# EAGLE design FSWSJE2IZ6BVKJ2 (EAGLE 9.5.2)
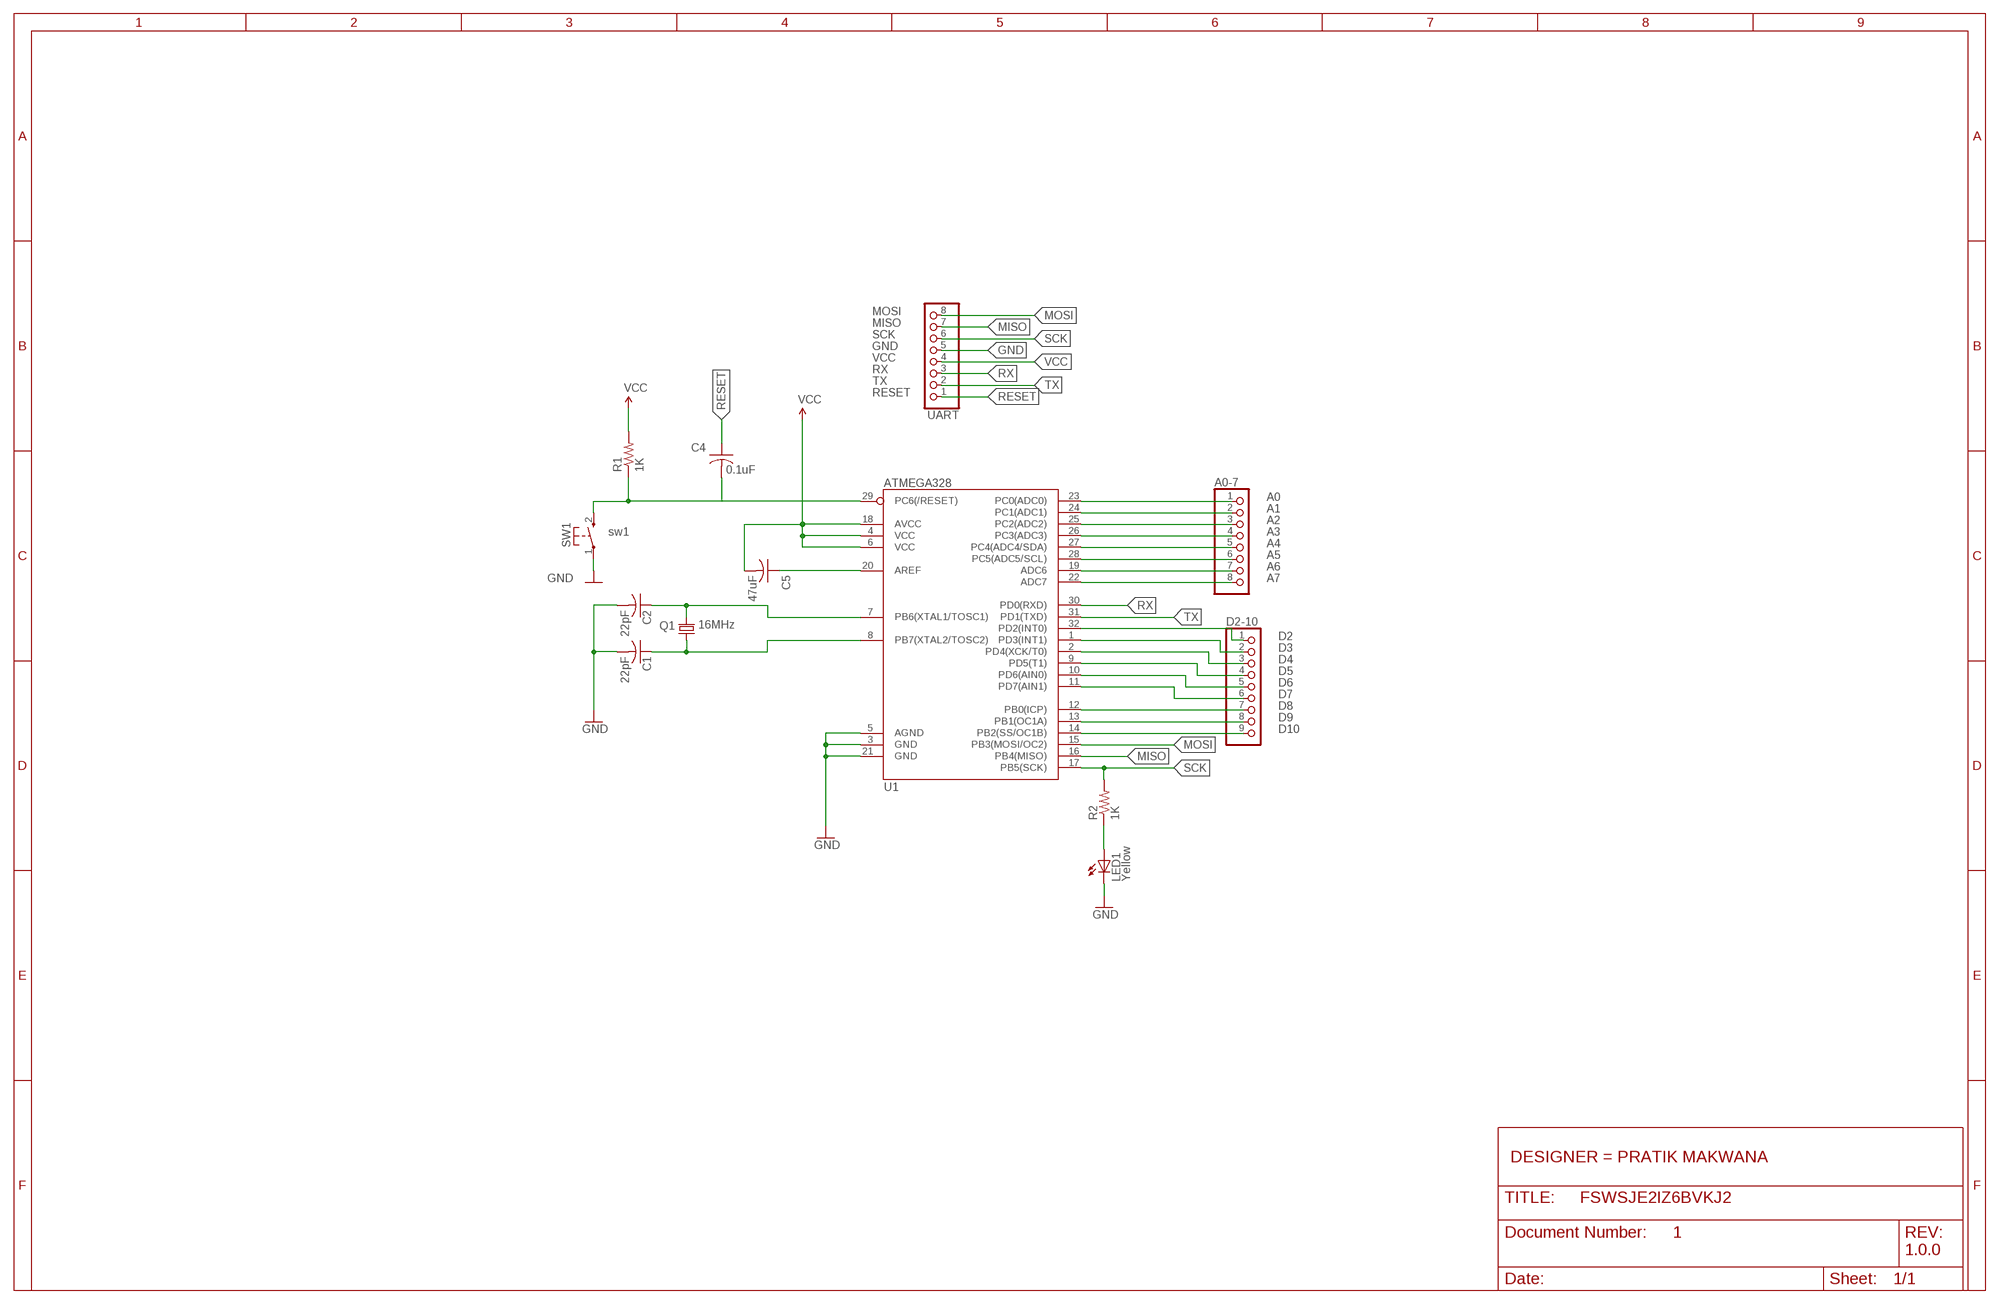
[diagram p0: schematic, sheet 1]
FRAME1 (FRAME_B_L): DESIGNER: PRATIK MAKWANA; DOC: 1; REV: 1.0.0

## Parts
A0-7  PINHD-1X8CLEANBIG  [1X08-CLEANBIG]
C1  22pF  C-USC1206  [C1206]
C2  22pF  C-USC1206  [C1206]
C4  0.1uF  C-USC0805  [C0805]
C5  47uF  C-USC0805  [C0805]
D2-10  PINHD-1X9  [1X09-BIG]
LED1  Yellow  LEDCHIP-LED0805  [CHIP-LED0805]
Q1  16MHz  CRYTALHC49S  [HC49/S]
R1  1K  R-US_R1206  [R1206]
R2  1K  R-US_R1206  [R1206]
SW1  sw1  KSS-2EG4430  [KSS-2EG4430]
U1  ATMEGA328  [TQFP32-08]
UART  PINHD-1X8CLEANBIG  [1X08-CLEANBIG]

## Nets
A0: A0-7.1 U1.23(PC0(ADC0))
A1: A0-7.2 U1.24(PC1(ADC1))
A2: A0-7.3 U1.25(PC2(ADC2))
A3: A0-7.4 U1.26(PC3(ADC3))
A4: A0-7.5 U1.27(PC4(ADC4/SDA))
A5: A0-7.6 U1.28(PC5(ADC5/SCL))
A6: A0-7.7 U1.19(ADC6)
A7: A0-7.8 U1.22(ADC7)
D2: D2-10.1 U1.32(PD2(INT0))
D3: D2-10.2 U1.1(PD3(INT1))
D4: D2-10.3 U1.2(PD4(XCK/T0))
D5: D2-10.4 U1.9(PD5(T1))
D6: D2-10.5 U1.10(PD6(AIN0))
D7: D2-10.6 U1.11(PD7(AIN1))
D8: D2-10.7 U1.12(PB0(ICP))
D9: D2-10.8 U1.13(PB1(OC1A))
D10: D2-10.9 U1.14(PB2(SS/OC1B))
GND: C1.2 C2.2 LED1.C SW1.1(P) U1.3(GND) U1.5(AGND) U1.21(GND) UART.5
MISO: U1.16(PB4(MISO)) UART.7
MOSI: U1.15(PB3(MOSI/OC2)) UART.8
N$1: C5.1 U1.20(AREF)
N$43: C2.1 Q1.2 U1.7(PB6(XTAL1/TOSC1))
N$44: C1.1 Q1.1 U1.8(PB7(XTAL2/TOSC2))
N$50: LED1.A R2.1
RESET: C4.1 UART.1
RST: C4.2 R1.1 SW1.2(S) U1.29(PC6(/RESET))
RX: U1.30(PD0(RXD)) UART.3
SCK: R2.2 U1.17(PB5(SCK)) UART.6
TX: U1.31(PD1(TXD)) UART.2
VCC: C5.2 R1.2 U1.4(VCC) U1.6(VCC) U1.18(AVCC) UART.4

## Library data of the parts
A0-7 UART = adafruit:PINHD-1X8: PIN HEADER
C1 C2 C4 C5 = adafruit:C-US: CAPACITOR, American symbol
D2-10 = adafruit:PINHD-1X9: Pin header 1x10 0.1" spacing With round pins
LED1 = adafruit:LED: LED OSRAM: - CHIPLED LG R971, LG N971, LY N971, LG Q971, LY Q971, LO R971, LY R971 LH N974, LH R974 LS Q976, LO Q976, LY Q976 LO Q996 - Hyper CHIPLED LW Q18S LB Q993, LB Q99A, LB R99A - SideLED LS A670, LO A670, LY A670, LG A670, LP A670 LB A673, LV A673, LT A673, LW A673 LH A674 LY A675 LS A676, LA A676, LO A676, LY A676, LW A676 LS A679, LY A679, LG A679 - Hyper Micro SIDELED® LS Y876, LA Y876, LO Y876, LY Y876 LT Y87S - SmartLED LW L88C, LW L88S LB L89C, LB L89S, LG L890 LS L89K, LO L89K, LY L89K LS L896, LA L896, LO L896, LY L896 - TOPLED LS T670, LO T670, LY T670, LG T670, LP T670 LSG T670, LSP T670, LSY T670, LOP T670, LYG T670 LG T671, LOG T671, LSG T671 LB T673, LV T673, LT T673, LW T673 LH T674 LS T676, LA T676, LO T676, LY T676, LB T676, LH T676, LSB T676, LW T676 LB T67C, LV T67C, LT T67C, LS T67K, LO T67K, LY T67K, LW E67C LS E67B, LA E67B, LO E67B, LY E67B, LB E67C, LV E67C, LT E67C LW T67C LS T679, LY T679, LG T679 LS T770, LO T770, LY T770, LG T770, LP T770 LB T773, LV T773, LT T773, LW T773 LH T774 LS E675, LA E675, LY E675, LS T675 LS T776, LA T776, LO T776, LY T776, LB T776 LHGB T686 LT T68C, LB T68C - Hyper Mini TOPLED® LB M676 - Mini TOPLED Santana® LG M470 LS M47K, LO M47K, LY M47K Source: http://www.osram.convergy.de/
Q1 = crystal:CRYTAL: CRYSTAL
R1 R2 = adafruit:R-US_: RESISTOR, American symbol
SW1 = buttons:KSS-2EG4430: Size: 3x6mm Height: 5mm from PCB Rating: DC12v 50mA Travel: 0.25±0.10mm Operating Force: 180±50gf Return Force: 60gf min Contact resistance: 100m? max Insulation resistance: 100M? min Operating life?50,000 cycles
U1 = thecustomgeek:ATMEGA328: ATmega328P-AU TQFP 32 pin

## Board
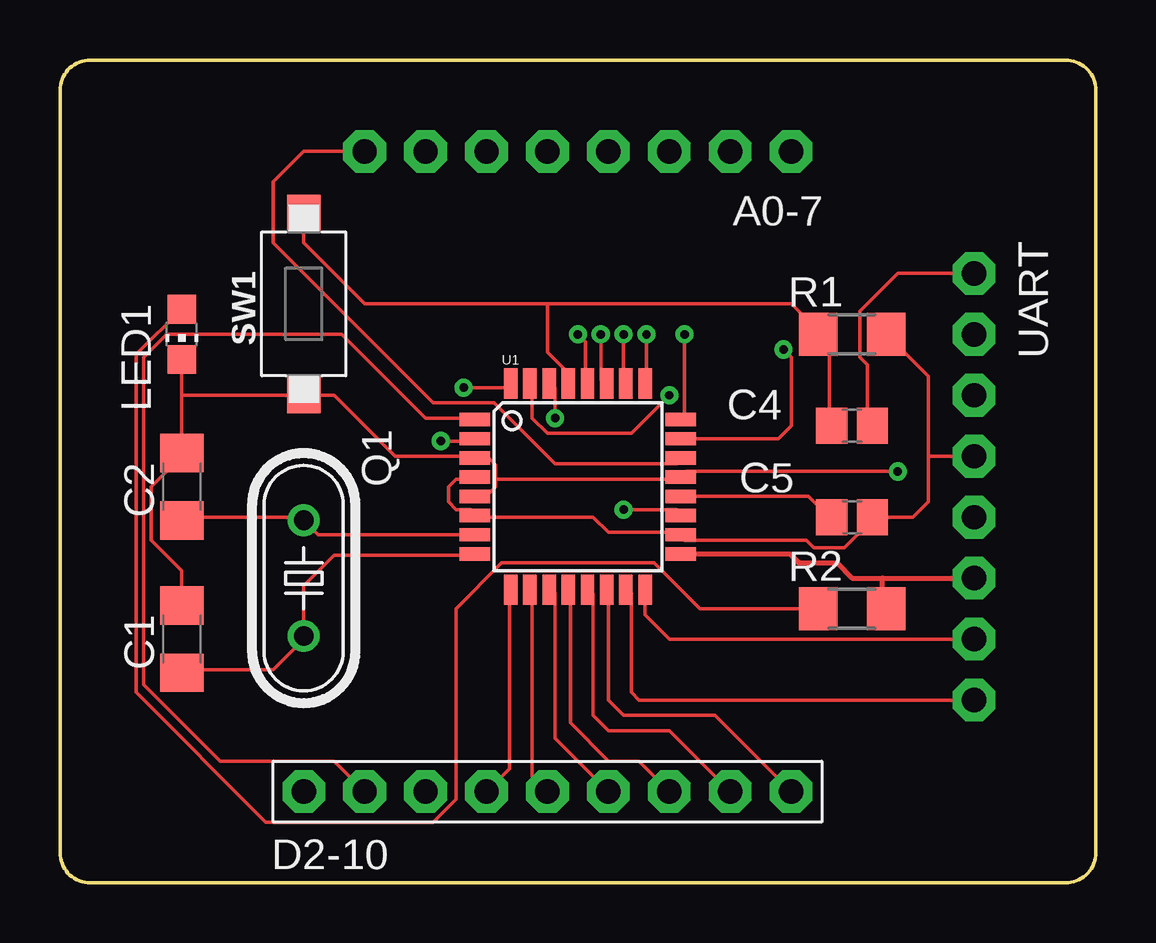
[diagram p1: board, top side]
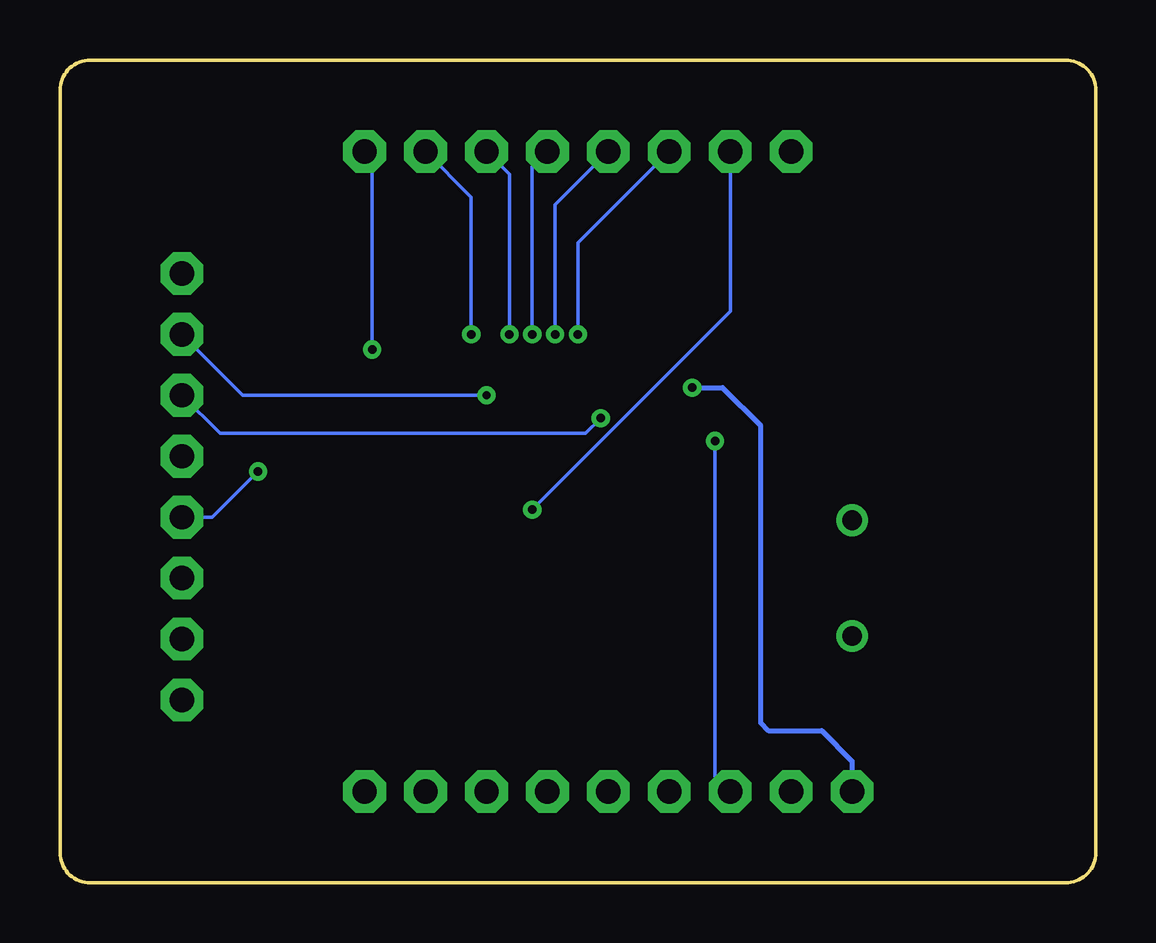
[diagram p2: board, bottom side, seen from below]

Size 43.18 x 34.29 mm. Coordinates in mm from the lower left corner, seen from the top.
Outline: 1.27,34.29 arc90 0,33.02 0,1.27 arc90 1.27,0 41.91,0 arc90 43.18,1.27 43.18,33.02 arc90 41.91,34.29 1.27,34.29
Copper layers (1*16): Top 0.035mm / dielectric 1.5mm / Bottom 0.035mm
Design rules "default": minimum track width 6mil, minimum drill 0.35mm, track to track 6mil, track to pad 6mil, pad to pad 6mil, via to via 6mil, smd to smd 6mil, copper to edge 40mil, drill to drill 6mil, minimum pad ring 10mil, minimum via ring 8mil, stop-mask expansion 4mil, vias tented up to drill 0mil, thermal gap 10mil

### Footprints (pad centres in the part's own frame; a part is rotated, then mirrored left to right if it is on the bottom)
1X08-CLEANBIG = drill 1.016 pad 1.778 octagon: 1 -8.89,0; 2 -6.35,0; 3 -3.81,0; 4 -1.27,0; 5 1.27,0; 6 3.81,0; 7 6.35,0; 8 8.89,0
C1206 = smd 1.6 x 1.8: 1 -1.4,0; 2 1.4,0
C0805 = smd 1.3 x 1.5: 1 -0.85,0; 2 0.85,0
1X09-BIG = drill 1.016 pad 1.778 octagon: 1 -10.16,0; 2 -7.62,0; 3 -5.08,0; 4 -2.54,0; 5 0,0; 6 2.54,0; 7 5.08,0; 8 7.62,0; 9 10.16,0
CHIP-LED0805 = smd 1.2 x 1.2: A 0,-1.05; C 0,1.05
HC49/S = drill 0.813: 1 -2.413,0; 2 2.413,0
R1206 = smd 1.6 x 1.803: 1 -1.422,0; 2 1.422,0
KSS-2EG4430 = smd 1.6 x 1.4: 1 -3.75,0; 2 3.75,0
TQFP32-08 = smd 1.27 x 0.559: 1 -4.293,2.8; 2 -4.293,2; 3 -4.293,1.2; 4 -4.293,0.4; 5 -4.293,-0.4; 6 -4.293,-1.2; 7 -4.293,-2; 8 -4.293,-2.8; 17 4.293,-2.8; 18 4.293,-2; 19 4.293,-1.2; 20 4.293,-0.4; 21 4.293,0.4; 22 4.293,1.2; 23 4.293,2; 24 4.293,2.8 | smd 0.559 x 1.27: 9 -2.8,-4.293; 10 -2,-4.293; 11 -1.2,-4.293; 12 -0.4,-4.293; 13 0.4,-4.293; 14 1.2,-4.293; 15 2,-4.293; 16 2.8,-4.293; 25 2.8,4.293; 26 2,4.293; 27 1.2,4.293; 28 0.4,4.293; 29 -0.4,4.293; 30 -1.2,4.293; 31 -2,4.293; 32 -2.8,4.293

### Placement (x,y rotation side)
A0-7  21.59,30.48 180 top
C1  5.08,10.16 90 top
C2  5.08,16.51 90 top
C4  33.02,19.05 180 top
C5  33.02,15.24 0 top
D2-10  20.32,3.81 0 top
LED1  5.08,22.86 180 top
Q1  10.16,12.7 90 top
R1  33.02,22.86 0 top
R2  33.02,11.43 0 top
SW1  10.16,24.13 90 top
U1  21.59,16.51 0 top
UART  38.1,16.51 270 top

### Tracks (layer width: path | path; a pad name or v marks a point on that pad's centre or on a via)
A0  (via drill 0.35)
  Top 0.152: U1.23 29.94,18.51 30.48,19.05 30.48,21.91 v30.16,22.23
  Bottom 0.152: v30.16,22.23 30.16,30.16 A0-7.1
A1  (via drill 0.35)
  Top 0.152: v26.04,22.86 26.04,19.37 U1.24
  Bottom 0.152: v26.04,22.86 26.04,28.57 A0-7.2
A2  (via drill 0.35)
  Top 0.152: v24.45,22.86 24.45,20.95 U1.25
  Bottom 0.152: v24.45,22.86 24.45,29.53 A0-7.3
A3  (via drill 0.35)
  Top 0.152: v23.5,22.86 23.5,20.95 U1.26
  Bottom 0.152: v23.5,22.86 23.5,29.84 A0-7.4
A4  (via drill 0.35)
  Top 0.152: v22.54,22.86 22.54,20.95 U1.27
  Bottom 0.152: v22.54,22.86 22.54,28.26 A0-7.5
A5  (via drill 0.35)
  Top 0.152: v21.59,22.86 21.91,22.54 21.91,20.95 U1.28
  Bottom 0.152: v21.59,22.86 21.59,26.67 A0-7.6
A6  (via drill 0.35)
  Top 0.152: v23.5,15.56 25.72,15.56 U1.19
  Bottom 0.152: v23.5,15.56 15.24,23.81 A0-7.7
A7
  Top 0.152: A0-7.8 10.16,30.48 8.89,29.21 8.89,26.67 15.56,20 18.1,20 20.64,17.46 25.72,17.46 U1.22
D2  (via drill 0.35)
  Top 0.152: v16.83,20.64 18.73,20.64 U1.32
  Bottom 0.203: v16.83,20.64 15.56,20.64 13.97,19.05 13.97,6.67 13.65,6.35 11.43,6.35 10.16,5.08 D2-10.1
D3
  Top 0.152: D2-10.2 11.43,5.08 6.67,5.08 3.49,8.26 3.49,21.91 4.45,22.86 11.75,22.86 15.24,19.37 17.14,19.37 U1.1
D4  (via drill 0.35)
  Top 0.152: v15.88,18.41 17.14,18.41 U1.2
  Bottom 0.152: v15.88,18.41 15.88,4.45 D2-10.3
D5
  Top 0.152: D2-10.4 18.73,4.76 18.73,12.06 U1.9
D6
  Top 0.152: D2-10.5 19.68,4.45 19.68,12.06 U1.10
D7
  Top 0.152: U1.11 20.64,12.06 20.64,6.03 D2-10.6
D8
  Top 0.152: D2-10.7 24.13,5.08 22.86,5.08 21.27,6.67 21.27,12.06 U1.12
D9
  Top 0.152: U1.13 22.23,12.06 22.23,6.99 22.86,6.35 25.4,6.35 D2-10.8
D10
  Top 0.152: U1.14 22.86,12.06 22.86,7.62 23.5,6.99 27.3,6.99 D2-10.9
GND  (via drill 0.35)
  Top 0.152: 5.08,20.32 C2.2 5.08,17.78 3.81,16.51 3.81,14.29 5.08,13.02 C1.2 | 5.08,20.32 LED1.C | 5.08,20.32 10.16,20.32 | 10.16,20.32 11.43,20.32 13.97,17.78 17.14,17.78 U1.3 17.87,17.71 18.16,17.42 18.16,16.83 | 10.16,20.32 SW1.1 | v34.92,17.14 26.12,17.14 U1.21 25.72,16.83 18.16,16.83 | 17.38,16.19 U1.5 17.76,16.11 18.16,16.51 18.16,16.83
  Bottom 0.152: v34.92,17.14 36.83,15.24 UART.5
MISO
  Top 0.152: U1.16 24.39,11.17 25.4,10.16 UART.7
MOSI
  Top 0.152: UART.8 24.13,7.62 23.81,7.94 23.81,12.06 U1.15
N$1
  Top 0.152: C5.1 32.07,15.24 31.2,16.11 U1.20
N$43
  Top 0.152: C2.1 5.08,15.24 10.16,15.24 Q1.2 10.76,14.51 U1.7
N$44
  Top 0.152: U1.8 17.14,13.65 11.43,13.65 10.16,12.38 Q1.1 10.16,10.16 8.89,8.89 5.08,8.89 C1.1
N$50
  Top 0.152: R2.1 26.67,11.43 24.77,13.34 18.41,13.34 16.51,11.43 16.51,3.49 15.56,2.54 8.57,2.54 3.17,7.94 3.17,22.02 5.06,23.91 LED1.A
RESET
  Top 0.152: UART.1 34.92,25.4 33.34,23.81 33.34,21.91 33.66,21.59 33.66,19.05 C4.1
RST
  Top 0.152: 31.75,22.86 32.07,22.54 32.07,19.05 C4.2 | 31.75,22.86 R1.1 | 20.32,24.13 30.48,24.13 31.75,22.86 | 20.32,24.13 20.32,22.11 21.19,21.24 U1.29 | 20.32,24.13 12.7,24.13 10.16,26.67 SW1.2
RX  (via drill 0.35)
  Top 0.152: U1.30 20.56,20.69 20.64,20.61 v20.64,19.37
  Bottom 0.152: v20.64,19.37 21.27,18.73 36.51,18.73 UART.3
SCK
  Top 0.152: 34.29,11.43 R2.2
  Top 0.203: U1.17 30.42,13.71 30.8,13.34 32.38,13.34 33.02,12.7 34.29,12.7 | 34.29,11.43 34.29,12.7 | 34.29,12.7 UART.6
TX  (via drill 0.35)
  Top 0.152: v25.4,20.32 23.81,18.73 20.32,18.73 19.68,19.37 19.68,20.64 U1.31
  Bottom 0.152: v25.4,20.32 35.56,20.32 UART.2
VCC
  Top 0.152: U1.4 17.14,16.83 16.51,16.83 16.19,16.51 16.19,15.88 16.51,15.56 17.14,15.56 U1.6 17.46,15.24 22.23,15.24 22.86,14.61 25.72,14.61 U1.18 26.04,14.29 31.11,14.29 31.43,13.97 32.7,13.97 33.97,15.24 | 33.97,15.24 35.56,15.24 36.2,15.88 36.2,17.78 | 34.61,22.86 R1.2 36.2,21.11 36.2,17.78 | 33.97,15.24 C5.2 | 36.2,17.78 UART.4